# EAGLE design remote (EAGLE 9.6.2)
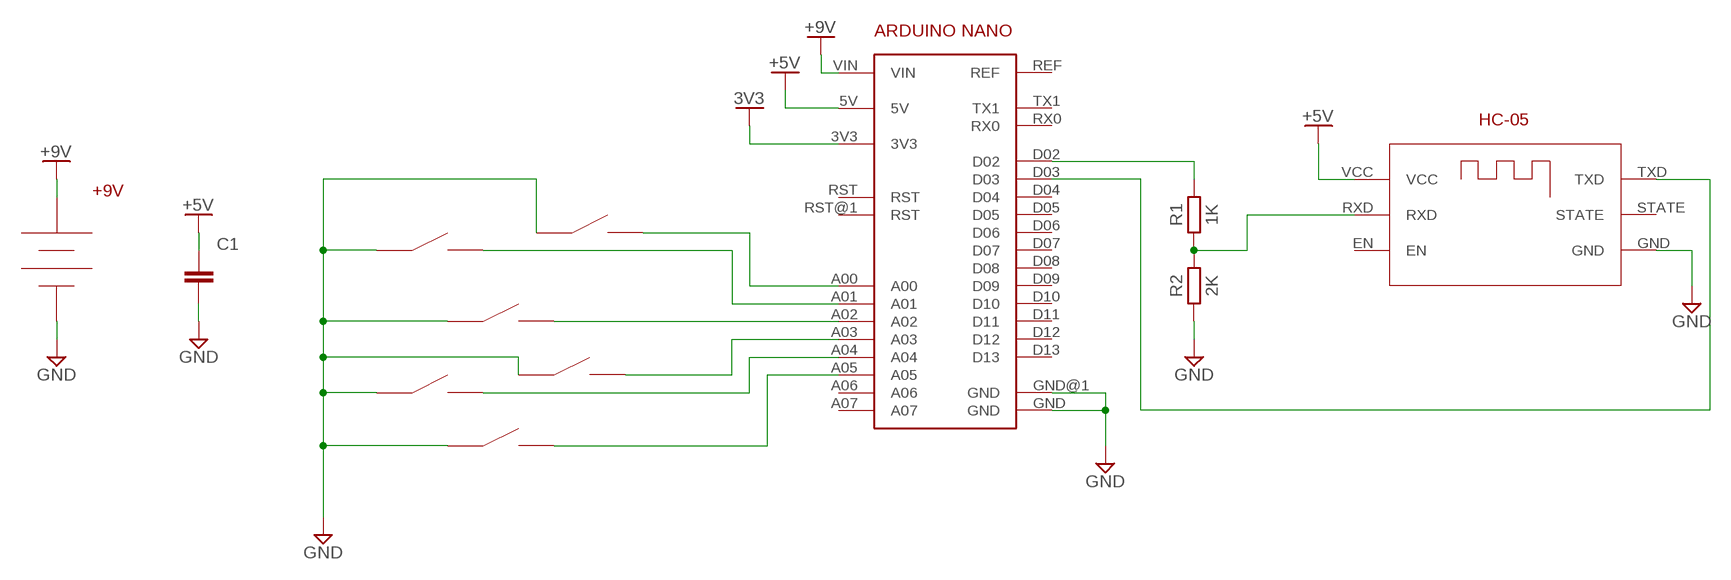
[diagram p0: schematic, sheet 1]

## Parts
C1  C_RADIAL-12.5MM-DIA  [CAPRD550W60D1025H1250B]
DOWN  TACT_SWITCH_6MM  [TACT_SWITCH_6MM]
LEFT  TACT_SWITCH_6MM  [TACT_SWITCH_6MM]
LEFT_BUMPER  TACT_SWITCH_6MM  [TACT_SWITCH_6MM]
R1  1K  R_AXIAL-11.7MM-PITCH  [RESAD1176W63L850D250B]
R2  2K  R_AXIAL-11.7MM-PITCH  [RESAD1176W63L850D250B]
RIGHT  TACT_SWITCH_6MM  [TACT_SWITCH_6MM]
RIGHT_BUMPER  TACT_SWITCH_6MM  [TACT_SWITCH_6MM]
U$1  9V_BATTERY  [9V_BATTERY]
U$2  HC-05  [HC-05]
U$9  ARDUINO-NANO-V3  [ARDUINO-NANO-V3]
UP  TACT_SWITCH_6MM  [TACT_SWITCH_6MM]

## Nets
3V3: U$9.3V3
+5V: C1.1 U$2.VCC U$9.5V
+9V: U$1.POS(9V) U$9.VIN
GND: C1.2 DOWN.A1(A) DOWN.A2(A) LEFT.A1(A) LEFT.A2(A) LEFT_BUMPER.A1(A) LEFT_BUMPER.A2(A) R2.1 RIGHT.A1(A) RIGHT.A2(A) RIGHT_BUMPER.A1(A) RIGHT_BUMPER.A2(A) U$1.NEG U$2.GND U$9.GND U$9.GND@1(GND) UP.A1(A) UP.A2(A)
N$1: R1.2 U$9.D02
N$2: RIGHT_BUMPER.B1(B) RIGHT_BUMPER.B2(B) U$9.A00
N$3: LEFT_BUMPER.B1(B) LEFT_BUMPER.B2(B) U$9.A01
N$4: U$9.A02 UP.B1(B) UP.B2(B)
N$5: RIGHT.B1(B) RIGHT.B2(B) U$9.A03
N$6: LEFT.B1(B) LEFT.B2(B) U$9.A04
N$7: DOWN.B1(B) DOWN.B2(B) U$9.A05
N$8: R1.1 R2.2 U$2.RXD
N$9: U$2.TXD U$9.D03
Unconnected: U$2.EN U$2.STATE U$9.A06 U$9.A07 U$9.D04 U$9.D05 U$9.D06 U$9.D07 U$9.D08 U$9.D09 U$9.D10 U$9.D11 U$9.D12 U$9.D13 U$9.REF U$9.RST U$9.RST@1(RST) U$9.RX0 U$9.TX1

## Library data of the parts
C1 = Capacitor:C: Capacitor - Generic; CATEGORY: Capacitor
DOWN LEFT LEFT_BUMPER RIGHT RIGHT_BUMPER UP = lib:TACT_SWITCH_6MM
R1 R2 = Resistor:R: Resistor Fixed - Generic; CATEGORY: Resistor; SUB-CATEGORY: Fixed
U$1 = lib:9V_BATTERY
U$2 = lib:HC-05
U$9 = rc_car:ARDUINO-NANO-V3

## Board
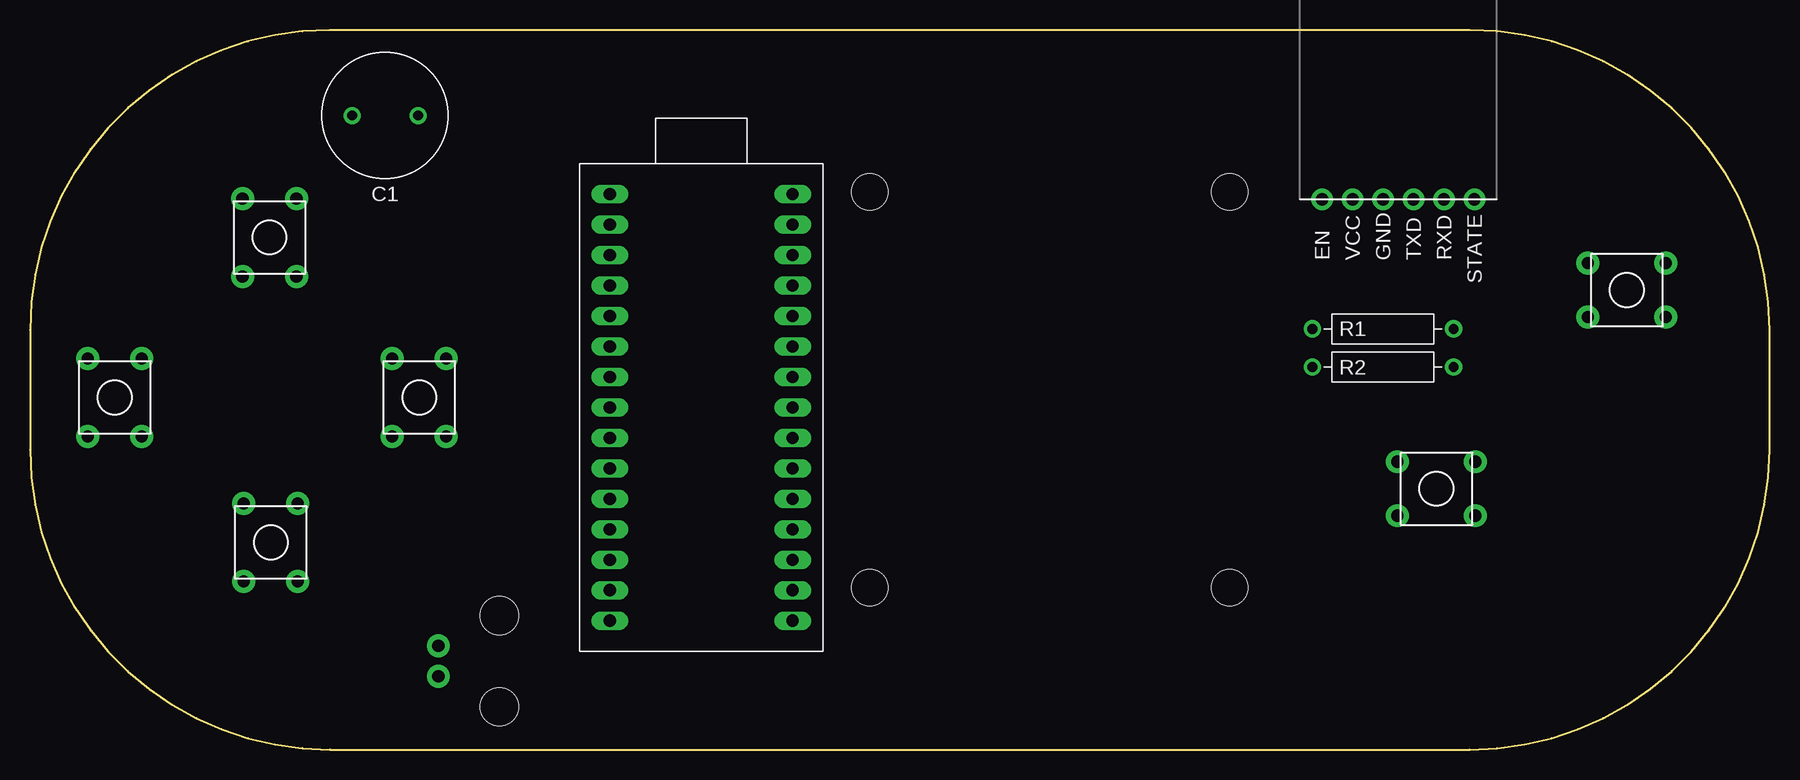
[diagram p1: board, top side]
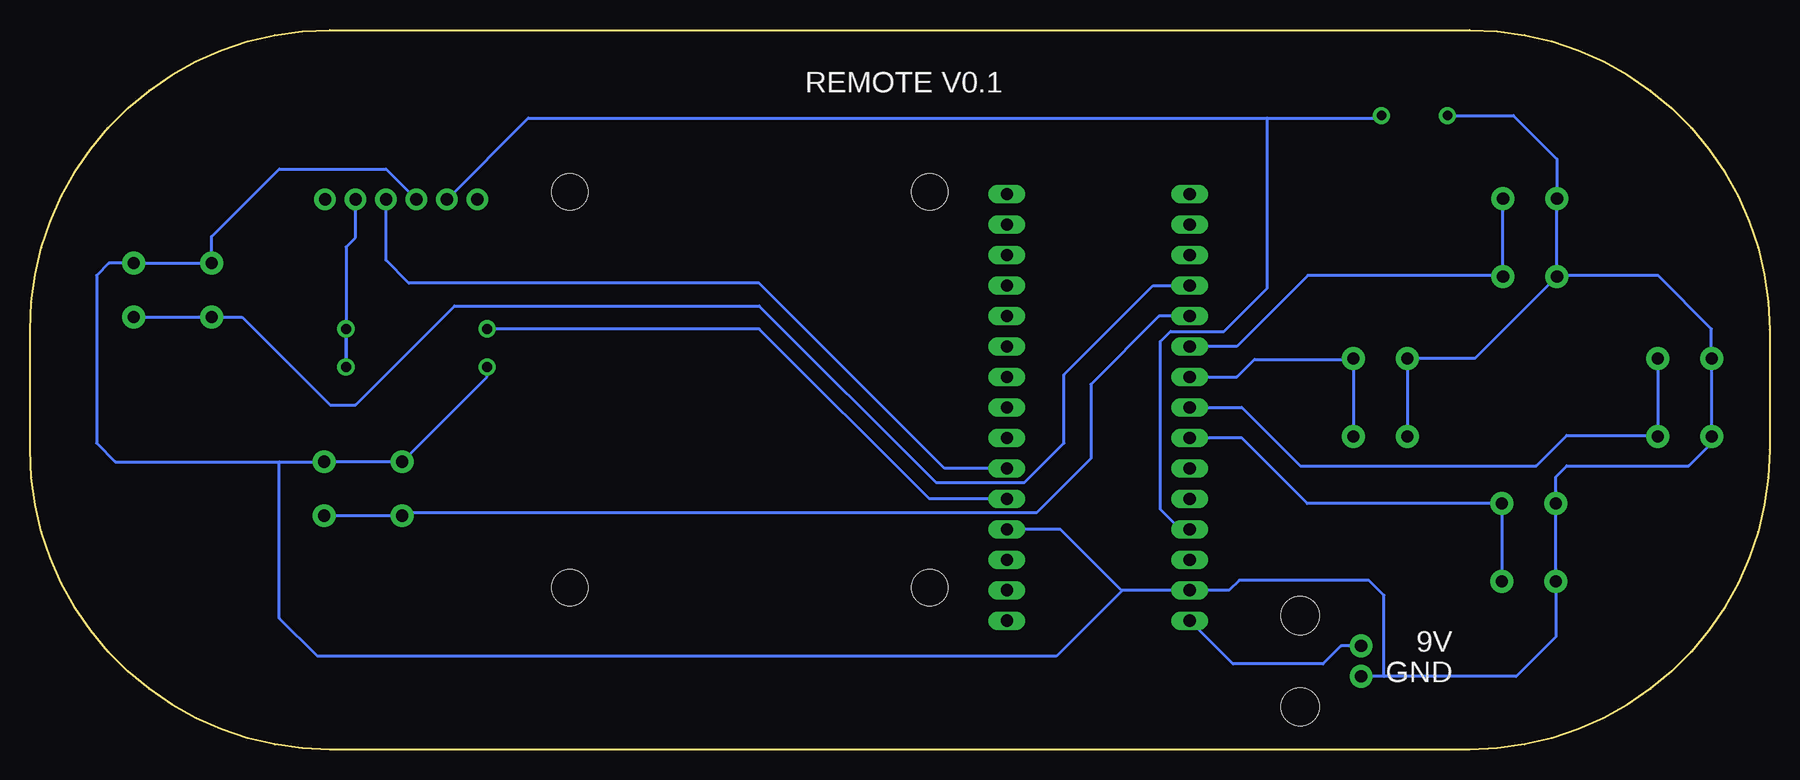
[diagram p2: board, bottom side, seen from below]

Size 145 x 60 mm. Coordinates in mm from the lower left corner, seen from the top.
Outline: 25,0 120,0 arc90 145,25 145,35 arc90 120,60 25,60 arc90 0,35 0,25 arc90 25,0
Copper layers (1*16): Top 0.035mm / dielectric 1.5mm / Bottom 0.035mm
Design rules "default": minimum track width 6mil, minimum drill 0.35mm, track to track 6mil, track to pad 6mil, pad to pad 6mil, via to via 6mil, smd to smd 6mil, copper to edge 40mil, drill to drill 6mil, minimum pad ring 10mil, minimum via ring 8mil, stop-mask expansion 4mil, vias tented up to drill 0mil, thermal gap 10mil
Holes 3 mm at 70,46.5 70,13.5 100,13.5 100,46.5

### Footprints (pad centres in the part's own frame; a part is rotated, then mirrored left to right if it is on the bottom)
CAPRD550W60D1025H1250B = drill 0.8 pad 1.4: 1 -2.75,0; 2 2.75,0
TACT_SWITCH_6MM = drill 1.016 pad 1.905: A1 -3.25,2.25; A2 3.25,2.25; B1 -3.25,-2.25; B2 3.25,-2.25
RESAD1176W63L850D250B = drill 0.83 pad 1.43: 1 -5.88,0; 2 5.88,0
9V_BATTERY = drill 1.016 pad 1.905: NEG -11.43,-6.35; POS -11.43,-8.89 | hole 3.175: -6.35,-3.81; -6.35,-11.43
HC-05 = drill 1.016 pad 1.778: EN -6.35,0; GND -1.27,0; RXD 3.81,0; STATE 6.35,0; TXD 1.27,0; VCC -3.81,0
ARDUINO-NANO-V3 = drill 1.016 long: 3V3 -15.24,-15.24; 5V 10.16,-15.24; A00 -10.16,-15.24; A01 -7.62,-15.24; A02 -5.08,-15.24; A03 -2.54,-15.24; A04 0,-15.24; A05 2.54,-15.24; A06 5.08,-15.24; A07 7.62,-15.24; D02 7.62,0; D03 5.08,0; D04 2.54,0; D05 0,0; D06 -2.54,0; D07 -5.08,0; D08 -7.62,0; D09 -10.16,0; D10 -12.7,0; D11 -15.24,0; D12 -17.78,0; D13 -17.78,-15.24; GND 10.16,0; GND@1 15.24,-15.24; REF -12.7,-15.24; RST 12.7,0; RST@1 12.7,-15.24; RX0 15.24,0; TX1 17.78,0; VIN 17.78,-15.24

### Placement (x,y rotation side)
C1  29.6,52.86 180 top
DOWN  20.08,17.26 90 top
LEFT  7.07,29.36 90 top
LEFT_BUMPER  117.23,21.74 0 top
R1  112.78,35.08 180 top
R2  112.78,31.91 0 top
RIGHT  32.45,29.36 90 top
RIGHT_BUMPER  133.11,38.31 0 top
U$1  45.48,-0.25 180 bottom
U$2  114.06,45.88 0 top
U$9  63.57,28.52 270 top
UP  19.97,42.7 90 top

### Tracks (layer width: path | path; a pad name or v marks a point on that pad's centre or on a via)
+5V
  Bottom 0.254: C1.1 32.35,52.65 41.88,52.65 | 41.88,52.65 41.88,38.46 45.46,34.87 49.93,34.87 50.77,34.04 50.77,20.04 49.09,18.36 U$9.5V | U$2.VCC 103.47,52.65 41.88,52.65
+9V
  Bottom 0.254: U$1.POS 35.72,8.64 37.22,7.14 44.73,7.14 U$9.VIN
GND
  Bottom 0.254: 17.72,39.52 UP.A1 24.55,32.62 RIGHT.A2 RIGHT.A1 | 17.72,39.52 UP.A2 17.72,49.23 21.34,52.86 C1.2 | U$2.GND 115.33,48.41 124.22,48.41 129.86,42.77 RIGHT_BUMPER.A1 RIGHT_BUMPER.A2 138.42,40.56 139.45,39.52 139.45,25.55 137.89,24 124.22,24 | 124.22,24 LEFT_BUMPER.A2 LEFT_BUMPER.A1 106.91,31.07 R2.1 | 53.94,13.28 U$9.GND@1 45.05,13.28 44.2,14.12 33.41,14.12 32.14,12.86 32.14,6.1 | 53.94,13.28 59.45,7.77 121.04,7.77 124.22,10.95 124.22,24 | 53.94,13.28 54.03,13.28 59.11,18.36 U$9.GND | 32.14,6.1 21.12,6.1 17.83,9.39 DOWN.A1 DOWN.A2 17.83,22.67 17.85,22.7 16.9,23.65 6.74,23.65 4.81,25.57 LEFT.A1 LEFT.A2 4.84,32.63 4.84,35.08 9.28,39.52 17.72,39.52 | 32.14,6.1 U$1.NEG
N$1
  Bottom 0.254: U$9.D02 70.03,20.9 84.21,35.08 R1.2
N$2
  Bottom 0.254: RIGHT_BUMPER.B2 RIGHT_BUMPER.B1 127.31,36.06 119.98,28.73 117.87,28.73 109.61,36.98 84.21,36.98 69.48,22.25 62.11,22.25 58.81,25.55 58.81,31.27 51.4,38.68 U$9.A00
N$3
  Bottom 0.254: LEFT_BUMPER.B2 LEFT_BUMPER.B1 113.73,19.75 61.1,19.75 56.58,24.27 56.58,30.46 50.89,36.14 U$9.A01
N$4
  Bottom 0.254: UP.B1 22.22,39.52 | 22.22,39.52 UP.B2 | U$9.A02 44.41,33.6 38.49,39.52 22.22,39.52
N$5
  Bottom 0.254: RIGHT.B2 34.7,32.54 | 34.7,32.54 RIGHT.B1 | U$9.A03 44.41,31.06 42.94,32.54 34.7,32.54
N$6
  Bottom 0.254: LEFT.B2 9.31,26.19 | 9.31,26.19 LEFT.B1 | U$9.A04 44,28.52 39.12,23.65 19.44,23.65 16.9,26.19 9.31,26.19
N$7
  Bottom 0.254: DOWN.B1 DOWN.B2 38.53,20.52 44,25.98 U$9.A05
N$8
  Bottom 0.254: R1.1 R2.2 118.66,41.9 117.87,42.7 U$2.RXD
N$9
  Bottom 0.254: U$9.D03 68.76,23.44 84.21,38.89 113.42,38.89 115.33,40.8 U$2.TXD

### Text on the board
bPlace: REMOTE V0.1